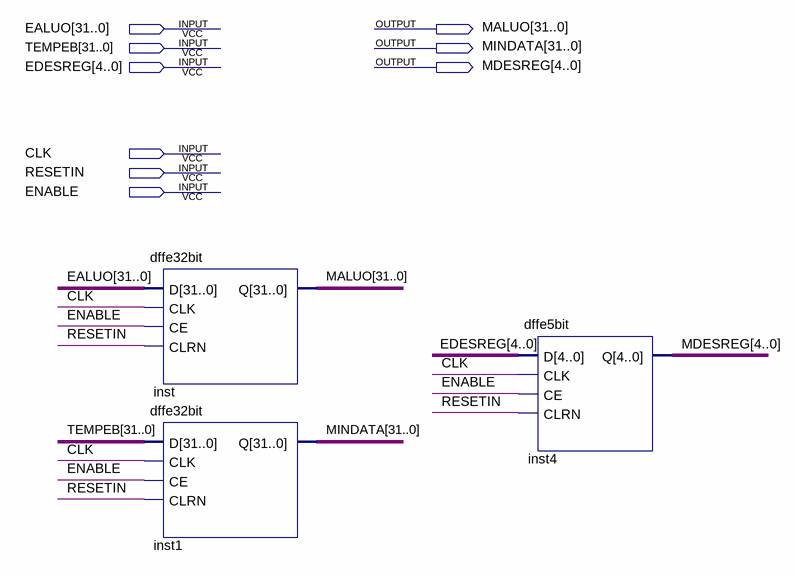
[diagram p0: schematic sheet]
// Quartus schematic EXE-MEM-INSTDATA-BUFFER.bdf as structural Verilog: 3 symbols, 9 pins
module \EXE-MEM-INSTDATA-BUFFER  (
  input  [31:0] EALUO,
  input  [31:0] TEMPEB,
  input  [4:0] EDESREG,
  input  CLK,
  input  RESETIN,
  input  ENABLE,
  output [31:0] MALUO,
  output [31:0] MINDATA,
  output [4:0] MDESREG
);

  dffe32bit inst (.D(EALUO), .CLK(CLK), .CE(ENABLE), .CLRN(RESETIN), .Q(MALUO));
  dffe32bit inst1 (.D(TEMPEB), .CLK(CLK), .CE(ENABLE), .CLRN(RESETIN), .Q(MINDATA));
  dffe5bit inst4 (.D(EDESREG), .CLK(CLK), .CE(ENABLE), .CLRN(RESETIN), .Q(MDESREG));
endmodule
